# Altium schematic sheet 1 PIC.SchDoc
size A
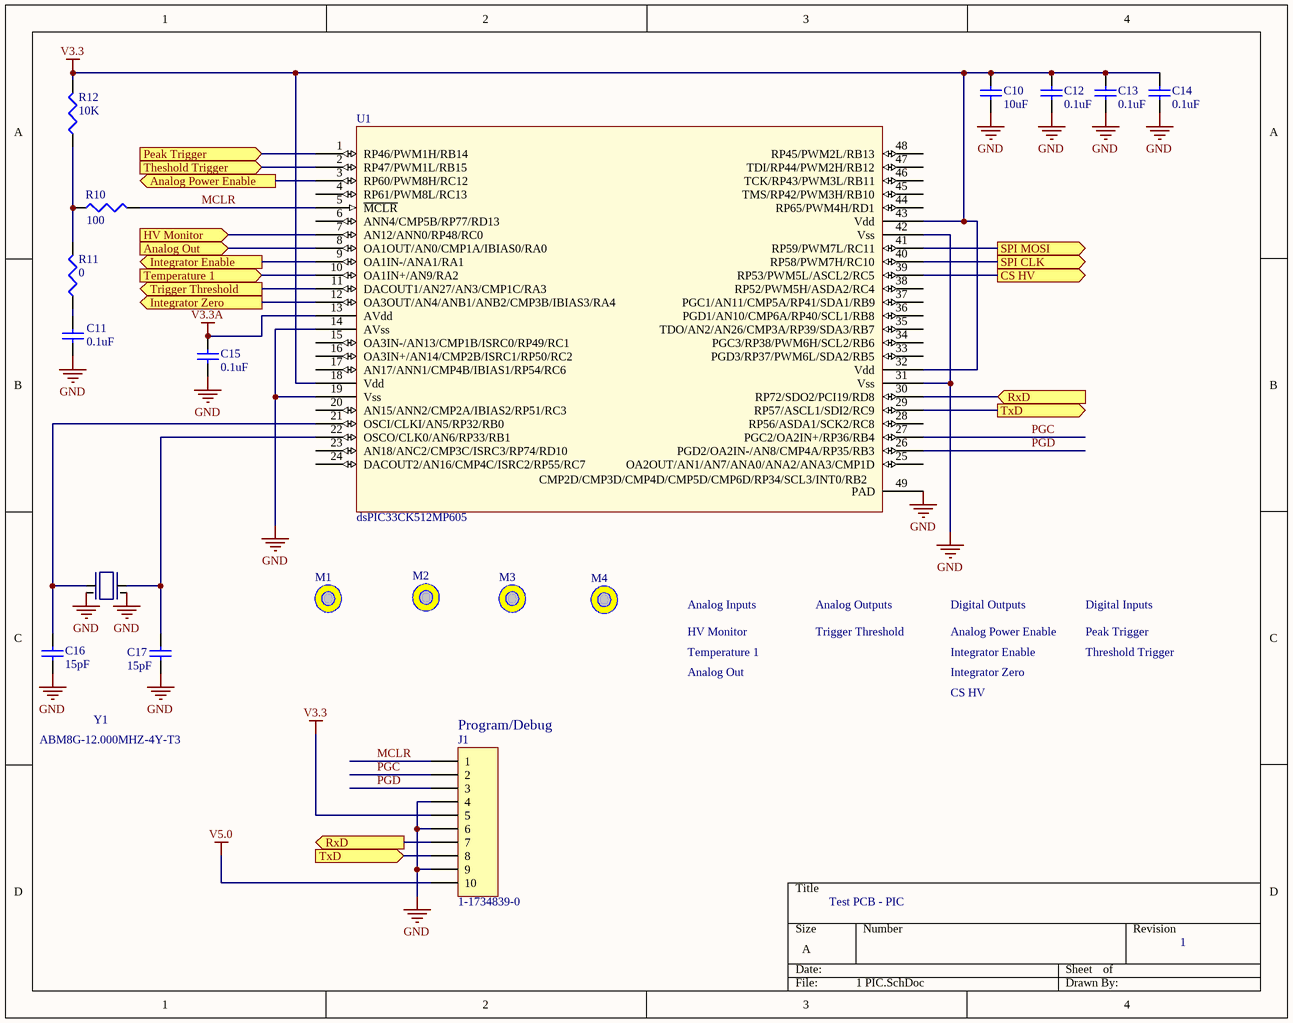
[diagram p0: 1 PIC.SchDoc]

## Parts
C10  10uF  [C0805]
C11  0.1uF  [C0402]
C12  0.1uF  [C0402]
C13  0.1uF  [C0402]
C14  0.1uF  [C0402]
C15  0.1uF  [C0402]
C16  15pF  [C0603]
C17  15pF  [C0603]
J1  1-1734839-0  [1-1734839-0]
M1  Mounting Hole  [Mounting Hole 0-80]  (value not drawn)
M2  Mounting Hole  [Mounting Hole 0-80]  (value not drawn)
M3  Mounting Hole  [Mounting Hole 0-80]  (value not drawn)
M4  Mounting Hole  [Mounting Hole 0-80]  (value not drawn)
R10  100  [R0603]
R11  0  [R0603]
R12  10K  [R0603]
U1  dsPIC33CK512MP605  [QFN40P600X600X90_HS-49N]
Y1  ABM8G-12.000MHZ-4Y-T3  [7M Series XTAL]

## Ports
Analog Out (in), Analog Power Enable (out), CS HV (out), HV Monitor (in), Integrator Enable (out), Integrator Zero (out), Peak Trigger (in), RxD (in), RxD (out), SPI CLK (out), SPI MOSI (out), Temperature 1 (in), Theshold Trigger (in), Trigger Threshold (out), TxD (in), TxD (out)

## Nets
GND: C10.1 C11.1 C12.1 C13.1 C14.1 C15.1 C16.1 C17.1 J1.4 J1.6 J1.9 U1.14(AVss) U1.19(Vss) U1.31(Vss) U1.42(Vss) U1.49(PAD) Y1.2 Y1.4
V3.3: C10.2 C12.2 C13.2 C14.2 J1.5 R12.2 U1.18(Vdd) U1.32(Vdd) U1.43(Vdd)
V3.3A: C15.2 U1.13(AVdd)
V5.0: J1.10
Analog Out: U1.8(OA1OUT/AN0/CMP1A/IBIAS0/RA0) ; port Analog Out
Analog Power Enable: U1.3(RP60/PWM8H/RC12) ; port Analog Power Enable
CS HV: U1.39(RP53/PWM5L/ASCL2/RC5) ; port CS HV
HV Monitor: U1.7(AN12/ANN0/RP48/RC0) ; port HV Monitor
Integrator Enable: U1.9(OA1IN-/ANA1/RA1) ; port Integrator Enable
Integrator Zero: U1.12(OA3OUT/AN4/ANB1/ANB2/CMP3B/IBIAS3/RA4) ; port Integrator Zero
MCLR: J1.1 R10.2 U1.5(~{MCLR})
Peak Trigger: U1.1(RP46/PWM1H/RB14) ; port Peak Trigger
PGC: J1.2 U1.27(PGC2/OA2IN+/RP36/RB4)
PGD: J1.3 U1.26(PGD2/OA2IN-/AN8/CMP4A/RP35/RB3)
RxD: J1.7 U1.30(RP72/SDO2/PCI19/RD8) ; port RxD
SPI CLK: U1.40(RP58/PWM7H/RC10) ; port SPI CLK
SPI MOSI: U1.41(RP59/PWM7L/RC11) ; port SPI MOSI
Temperature 1: U1.10(OA1IN+/AN9/RA2) ; port Temperature 1
Theshold Trigger: U1.2(RP47/PWM1L/RB15) ; port Theshold Trigger
Trigger Threshold: U1.11(DACOUT1/AN27/AN3/CMP1C/RA3) ; port Trigger Threshold
TxD: J1.8 U1.29(RP57/ASCL1/SDI2/RC9) ; port TxD
NetC11_2: C11.2 R11.1
NetC16_2: C16.2 U1.21(OSCI/CLKI/AN5/RP32/RB0) Y1.1
NetC17_2: C17.2 U1.22(OSCO/CLK0/AN6/RP33/RB1) Y1.3
NetR10_1: R10.1 R11.2 R12.1

Not connected (* = marked no-connect by the designer): U1 4(RP61/PWM8L/RC13) 6(ANN4/CMP5B/RP77/RD13) 15(OA3IN-/AN13/CMP1B/ISRC0/RP49/RC1) 16(OA3IN+/AN14/CMP2B/ISRC1/RP50/RC2) 17(AN17/ANN1/CMP4B/IBIAS1/RP54/RC6) 20(AN15/ANN2/CMP2A/IBIAS2/RP51/RC3) 23(AN18/ANC2/CMP3C/ISRC3/RP74/RD10) 24(DACOUT2/AN16/CMP4C/ISRC2/RP55/RC7) 25(OA2OUT/AN1/AN7/ANA0/ANA2/ANA3/CMP1D) 28(RP56/ASDA1/SCK2/RC8) 33(PGD3/RP37/PWM6L/SDA2/RB5) 34(PGC3/RP38/PWM6H/SCL2/RB6) 35(TDO/AN2/AN26/CMP3A/RP39/SDA3/RB7) 36(PGD1/AN10/CMP6A/RP40/SCL1/RB8) 37(PGC1/AN11/CMP5A/RP41/SDA1/RB9) 38(RP52/PWM5H/ASDA2/RC4) 44(RP65/PWM4H/RD1) 45(TMS/RP42/PWM3H/RB10) 46(TCK/RP43/PWM3L/RB11) 47(TDI/RP44/PWM2H/RB12) 48(RP45/PWM2L/RB13)

## Notes on the sheet
- Analog Inputs
- HV Monitor
- Analog Outputs
- Trigger Threshold
- Digital Outputs
- Analog Power Enable
- Digital Inputs
- Peak Trigger
- Temperature 1
- Analog Out
- Integrator Enable
- Integrator Zero
- CS HV
- Threshold Trigger
- (near J1) Program/Debug
- Test PCB - PIC
- 1
- (in symbol dsPIC33CK512MP605) CMP2D/CMP3D/CMP4D/CMP5D/CMP6D/RP34/SCL3/INT0/RB2

## Library data of the parts
C10-C17 = Cap SM: Capacitor, SM; Published: 8-Jun-2000; LatestRevisionDate: 29-May-2009; LatestRevisionNote: IPC-7351 Footprint Added.; PackageReference: C1206; Publisher: Altium Limited; PackageDescription: Chip Capacitor
  C10: Value: 10uF
  C11-C15: Value: 0.1uF
  C16 C17: Value: 15pF
J1 = Header 10: LatestRevisionDate: 17-Jul-2002; LatestRevisionNote: Re-released for DXP Platform.; Publisher: Altium Limited; Part Number: 1-1734839-0
R10-R12 = Res SM: Resistor; Published: 8-Jun-2000; LatestRevisionDate: 29-May-2009; LatestRevisionNote: IPC-7351 Footprint Added.; PackageReference: J1-0603; Publisher: Altium Limited; PackageDescription: Chip Resistor
  R10: Value: 100
  R11: Value: 0
  R12: Value: 10K
U1 = dsPIC33CK512MP605: Microcontroller
Y1 = Crystal 4 Terminal